# Altium schematic sheet fpga-power.SchDoc: CS - FPGA - Power
size Letter; CheckedBy: J. Brinton; CompanyName: Signal Laboratories, Inc.; DrawnBy: J. Brinton; Engineer: J. Brinton; Address1: 3479 Edison Way; Address2: Menlo Park CA 94025; Address3: +1 (877) 778-8435; Address4: siglabs.com; Revision: 3; SheetNumber: 13; SheetTotal: 47
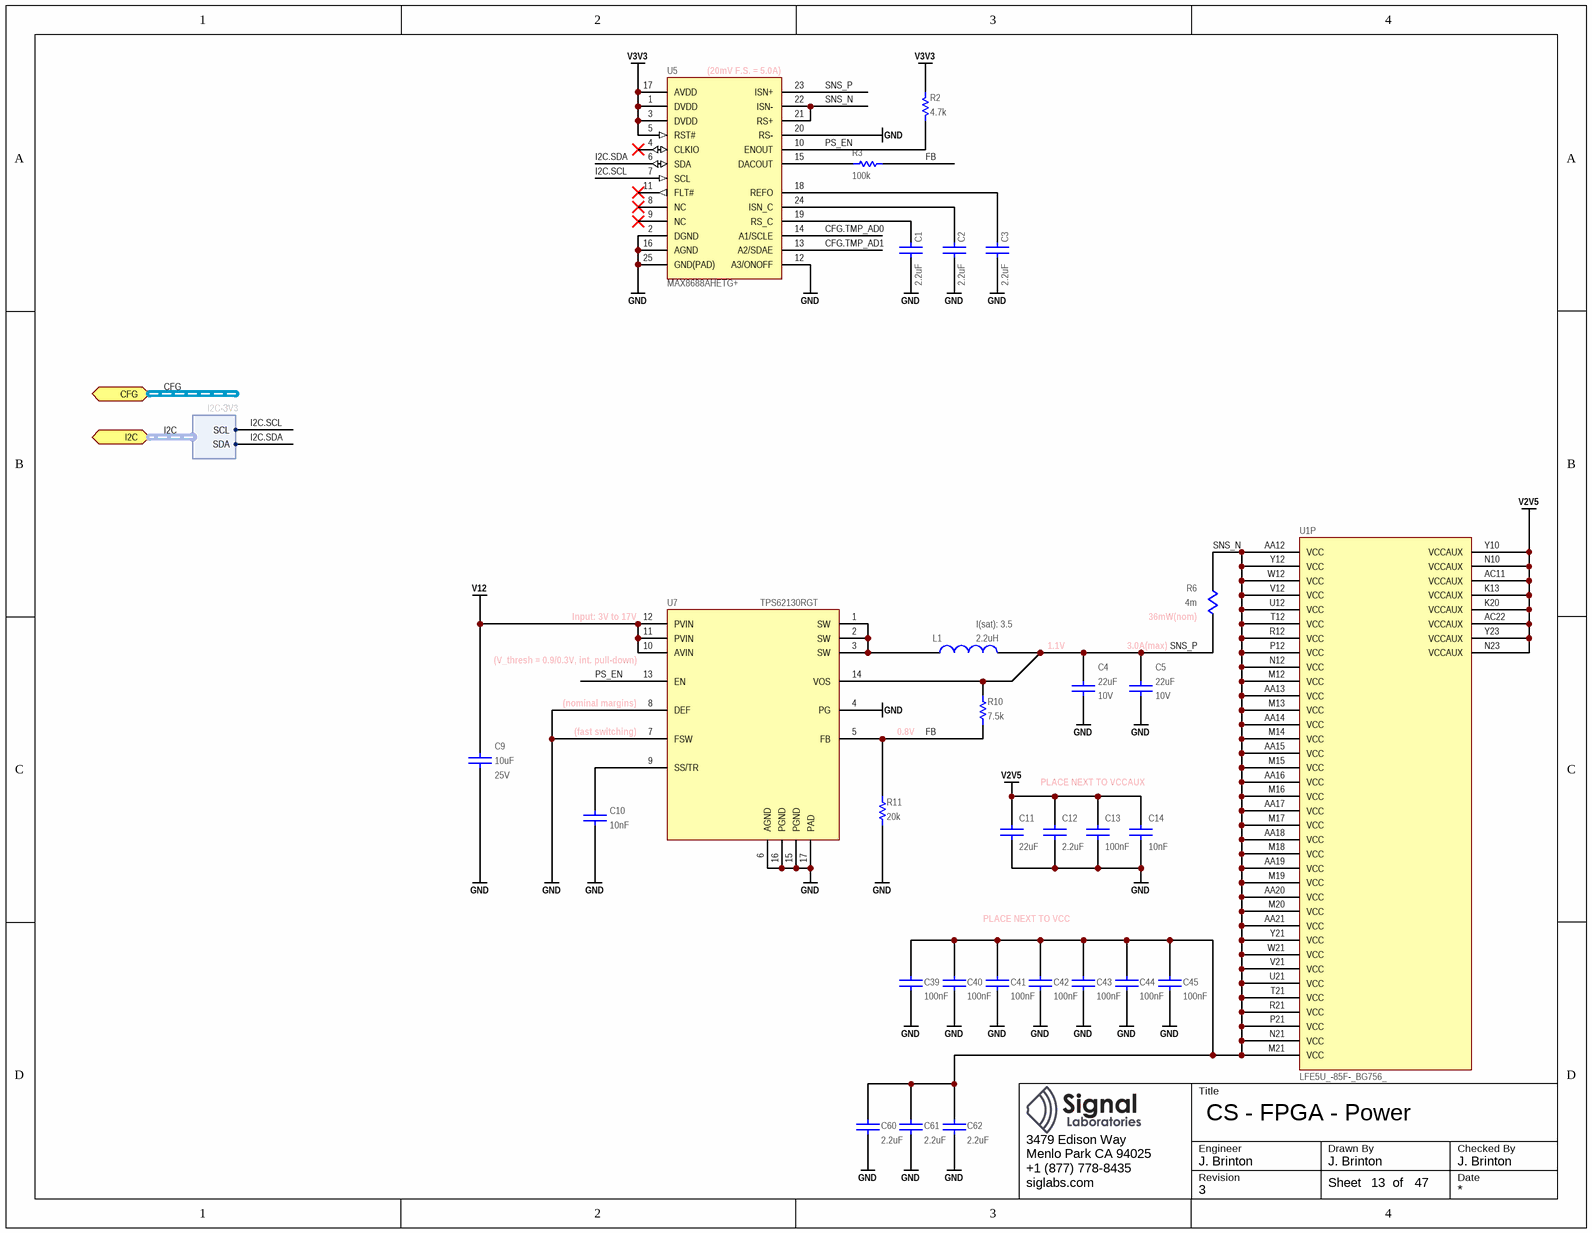
[diagram p0: fpga-power.SchDoc]

## Parts
C1  value 2.2uF  [CAPC160X80X90L20N]  (hidden comment: C1608X7R1A225M080)
C2  value 2.2uF  [CAPC160X80X90L20N]  (hidden comment: C1608X7R1A225M080)
C3  value 2.2uF  [CAPC160X80X90L20N]  (hidden comment: C1608X7R1A225M080)
C4  value 22uF  Voltage: 10V  [CAPC200X125X145L45N]  (hidden comment: C2012X7S1A226M125)
C5  value 22uF  Voltage: 10V  [CAPC200X125X145L45N]  (hidden comment: C2012X7S1A226M125)
C9  value 10uF  Voltage: 25V  [CAPC200X125X145L45N]  (hidden comment: GRM21BC81E106KE51)
C10  value 10nF  [CAPC100X50X55L25N]  (hidden comment: GRM155R71H103KA88)
C11  value 22uF  [CAPC200X125X145L45N]  (hidden comment: C2012X7S1A226M125)
C12  value 2.2uF  [CAPC160X80X90L20N]  (hidden comment: C1608X7R1A225M080)
C13  value 100nF  [CAPC100X50X55L25N]  (hidden comment: GCM155R71H104KE02)
C14  value 10nF  [CAPC100X50X55L25N]  (hidden comment: GRM155R71H103KA88)
C39  value 100nF  [CAPC100X50X55L25N]  (hidden comment: GCM155R71H104KE02)
C40  value 100nF  [CAPC100X50X55L25N]  (hidden comment: GCM155R71H104KE02)
C41  value 100nF  [CAPC100X50X55L25N]  (hidden comment: GCM155R71H104KE02)
C42  value 100nF  [CAPC100X50X55L25N]  (hidden comment: GCM155R71H104KE02)
C43  value 100nF  [CAPC100X50X55L25N]  (hidden comment: GCM155R71H104KE02)
C44  value 100nF  [CAPC100X50X55L25N]  (hidden comment: GCM155R71H104KE02)
C45  value 100nF  [CAPC100X50X55L25N]  (hidden comment: GCM155R71H104KE02)
C60  value 2.2uF  [CAPC160X80X90L20N]  (hidden comment: C1608X7R1A225M080)
C61  value 2.2uF  [CAPC160X80X90L20N]  (hidden comment: C1608X7R1A225M080)
C62  value 2.2uF  [CAPC160X80X90L20N]  (hidden comment: C1608X7R1A225M080)
L1  value 2.2uH  I(sat): 3.5  [XFL4020]  (hidden comment: XFL4020-222ME)
R2  value 4.7k  [RESC1005X40N]  (hidden comment: ERJ-2RKF4701X)
R3  value 100k  [RESC1005X40N]  (hidden comment: ERJ-2RKF1003X)
R6  value 4m  [RESC3216X80L110N]  (hidden comment: CSR1206-0R004F1)
R10  value 7.5k  [RESC2012X70N]  (hidden comment: ERA-6AEB752V)
R11  value 20k  [RESC2012X70N]  (hidden comment: ERA-6AEB203V)
U1  LFE5U_-85F-_BG756_  [caBGA756]  (part P of 19)
U5  MAX8688AHETG+  [QFN25P50_400X400X80L40X24T260N]
U7  TPS62130RGT  [S-PQFP-8N_NOVIA]

## Ports
CFG (harness CFG), I2C (harness I2C-3V3)

## Harnesses
I2C-3V3: SCL, SDA

## Nets
GND: C1.1 C2.1 C3.1 C4.1 C5.1 C9.1 C10.2 C11.1 C12.1 C13.1 C14.2 C39.1 C40.1 C41.1 C42.1 C43.1 C44.1 C45.1 C60.1 C61.1 C62.1 R11.1 U5.2(DGND) U5.12(A3/ONOFF) U5.16(AGND) U5.20(RS-) U5.25(GND(PAD)) U7.4(PG) U7.6(AGND) U7.7(FSW) U7.8(DEF) U7.15(PGND) U7.16(PGND) U7.17(PAD)
V2V5: C11.2 C12.2 C13.2 C14.1 U1.AC11(VCCAUX) U1.AC22(VCCAUX) U1.K13(VCCAUX) U1.K20(VCCAUX) U1.N10(VCCAUX) U1.N23(VCCAUX) U1.Y10(VCCAUX) U1.Y23(VCCAUX)
V3V3: R2.2 U5.1(DVDD) U5.3(DVDD) U5.5(RST#) U5.17(AVDD)
V12: C9.2 U7.10(AVIN) U7.11(PVIN) U7.12(PVIN)
CFG.TMP_AD0: U5.14(A1/SCLE)
CFG.TMP_AD1: U5.13(A2/SDAE)
FB: R3.2 R10.1 R11.2 U7.5(FB)
I2C.SCL: U5.7(SCL) ; port I2C.SCL
I2C.SDA: U5.6(SDA) ; port I2C.SDA
PS_EN: R2.1 U5.10(ENOUT) U7.13(EN)
SNS_N: C39.2 C40.2 C41.2 C42.2 C43.2 C44.2 C45.2 C60.2 C61.2 C62.2 R6.2 U1.AA12(VCC) U1.AA13(VCC) U1.AA14(VCC) U1.AA15(VCC) U1.AA16(VCC) U1.AA17(VCC) U1.AA18(VCC) U1.AA19(VCC) U1.AA20(VCC) U1.AA21(VCC) U1.M12(VCC) U1.M13(VCC) U1.M14(VCC) U1.M15(VCC) U1.M16(VCC) U1.M17(VCC) U1.M18(VCC) U1.M19(VCC) U1.M20(VCC) U1.M21(VCC) U1.N12(VCC) U1.N21(VCC) U1.P12(VCC) U1.P21(VCC) U1.R12(VCC) U1.R21(VCC) U1.T12(VCC) U1.T21(VCC) U1.U12(VCC) U1.U21(VCC) U1.V12(VCC) U1.V21(VCC) U1.W12(VCC) U1.W21(VCC) U1.Y12(VCC) U1.Y21(VCC) U5.21(RS+) U5.22(ISN-)
SNS_P: C4.2 C5.2 L1.2 R6.1 R10.2 U5.23(ISN+) U7.14(VOS)
NetC1_2: C1.2 U5.19(RS_C)
NetC2_2: C2.2 U5.24(ISN_C)
NetC3_2: C3.2 U5.18(REFO)
NetC10_1: C10.1 U7.9(SS/TR)
NetL1_1: L1.1 U7.1(SW) U7.2(SW) U7.3(SW)
NetR3_1: R3.1 U5.15(DACOUT)

Not connected (* = marked no-connect by the designer): U5 4(CLKIO)* 8(NC)* 9(NC)* 11(FLT#)*

## Buses and harness runs
harness CFG = port CFG
harness I2C = port I2C

## Notes on the sheet
- (near U5) (20mV F.S. = 5.0A)
- (near U7) Input: 3V to 17V
- (near U7) (V_thresh = 0.9/0.3V, int. pull-down)
- 1.1V
- (near C5) 3.0A(max)
- (near R6) 36mW(nom)
- (near U7) (fast switching)
- (near U7) (nominal margins)
- 0.8V
- PLACE NEXT TO VCCAUX
- PLACE NEXT TO VCC
- Title
- Engineer
- Revision
- Drawn By
- Checked By
- Date
- Sheet
- of

## Library data of the parts
C1-C3 C12 C60-C62 = CAP: Ceramic Capacitor 2.2uF ±20% 10V X7R 0603; Manufacturer: TDK; Tr: -55:125; Manufacturer P/N: C1608X7R1A225M080; Tolerance: ±20%; Voltage: 10V; Footprint: *; Package: 0603
C4 C5 C11 = CAP: Ceramic Capacitor 22uF ±20% 10V X7S 0805; Manufacturer: TDK; Tr: -55:125; Manufacturer P/N: C2012X7S1A226M125; Tolerance: ±20%; Package: 0805
  C11: Voltage: 10V
C9 = CAP: Ceramic Capacitor 10uF ±10% 25V X6S 0805; Manufacturer: Murata; Tr: -55:105; Manufacturer P/N: GRM21BC81E106KE51; Tolerance: ±10%; Package: 0805
C10 C14 = CAP: Ceramic Capacitor 10nF ±10% 50V X7R 0402; Manufacturer: Murata; Tr: -55:125; Manufacturer P/N: GRM155R71H103KA88; Tolerance: ±10%; Voltage: 50V; Package: 0402
C13 C39-C45 = CAP: Ceramic Capacitor 100nF ±10% 50V X7R 0402; Manufacturer: Murata; Tr: -55:125; Manufacturer P/N: GCM155R71H104KE02; Tolerance: ±10%; Voltage: 50V; Footprint: *; Package: 0402
L1 = COIL: Wirewound Inductor 2.2uH +/-20% 3.5A SMD; Manufacturer: Coilcraft; Manufacturer P/N: XFL4020-222ME
R2 = RES: Thick Film Resistor 4.7k ±1% 0.1W 75V 0402; Manufacturer: Panasonic; Tcr: ±100; Tr: -55:155; Voltage: 75; Power: 0.1; Tolerance: ±1%; Manufacturer P/N: ERJ-2RKF4701X; Alternatives: *; Footprint: *; Package: 0402
R3 = RES: Thick Film Resistor 100k ±1% 0.1W 50V 0402; Manufacturer: Panasonic; Tcr: ±100; Tr: -55:155; Voltage: 50; Power: 0.1; Manufacturer P/N: ERJ-2RKF1003X; Tolerance: ±1%; Alternatives: *; Footprint: *; Package: 0402
R6 = CSR1206-0R001F1: Current Sense Resistor 4mOhm +/-1% SMD 1206; Manufacturer: Riedon; Manufacturer P/N: CSR1206-0R004F1; Package: 1206
R10 = RES: Thin Film Resistor 7.5k ±0.1% 0.125W 100V 0805; Manufacturer: Panasonic; Tcr: ±25; Tr: -55:155; Voltage: 100; Power: 0.125; Tolerance: ±0.1%; Manufacturer P/N: ERA-6AEB752V; Alternatives: *; Footprint: *; Package: 0805
R11 = RES: Thin Film Resistor 20k ±0.1% 0.125W 100V 0805; Manufacturer: Panasonic; Tcr: ±25; Tr: -55:155; Voltage: 100; Power: 0.125; Tolerance: ±0.1%; Manufacturer P/N: ERA-6AEB203V; Alternatives: *; Footprint: *; Package: 0805
U1 = LFE5U_-85F-_BG756_: ECP5 FPGA, 85k LUT, 756-caBGA; Manufacturer: Lattice Semiconductor; Manufacturer P/N: LFE5U_-85F-_BG756_
U5 = MAX8688AHETG+: Digital Power-Supply Controller/Monitor; Manufacturer: Maxim Integrated; Manufacturer P/N: MAX8688AHETG+
U7 = TPS62130RGT: 3-17V 3A Step-Down Converter VQFN; Manufacturer: Texas Instruments; Manufacturer P/N: TPS62130RGT